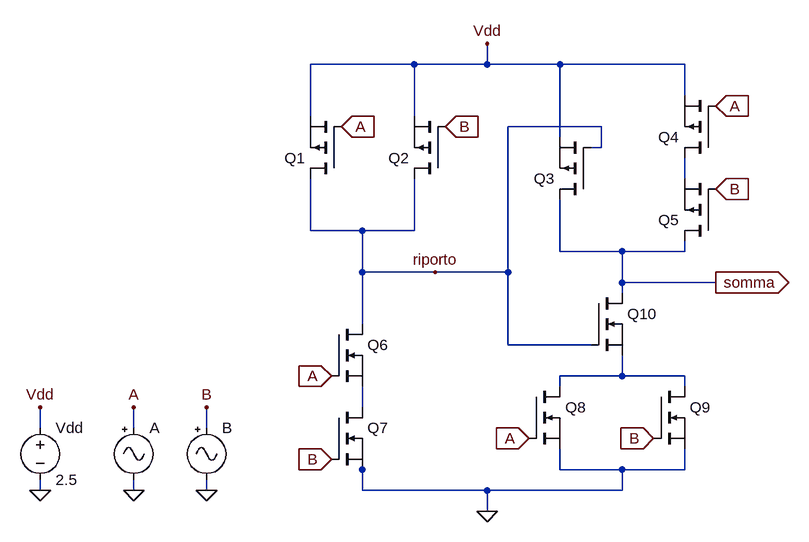
[diagram p0: schematic circuito2.asc]
circuito2.asc, the LTspice schematic file:
Version 4
SHEET 1 880 724
WIRE 192 16 32 16
WIRE 304 16 304 -16
WIRE 304 16 192 16
WIRE 416 16 304 16
WIRE 608 16 416 16
WIRE 608 64 608 16
WIRE 32 96 32 16
WIRE 192 96 192 16
WIRE 480 112 336 112
WIRE 416 128 416 16
WIRE 480 144 480 112
WIRE 480 144 464 144
WIRE 608 192 608 160
WIRE 32 272 32 192
WIRE 112 272 32 272
WIRE 192 272 192 192
WIRE 192 272 112 272
WIRE 416 304 416 224
WIRE 512 304 416 304
WIRE 608 304 608 288
WIRE 608 304 512 304
WIRE 112 336 112 272
WIRE 224 336 112 336
WIRE 336 336 336 112
WIRE 336 336 224 336
WIRE 512 352 512 304
WIRE 656 352 512 352
WIRE 512 368 512 352
WIRE 112 416 112 336
WIRE 336 448 336 336
WIRE 464 448 336 448
WIRE 512 496 512 464
WIRE 512 496 416 496
WIRE 608 496 512 496
WIRE 416 512 416 496
WIRE 608 512 608 496
WIRE 112 544 112 512
WIRE -384 576 -384 544
WIRE -240 576 -240 544
WIRE -128 576 -128 544
WIRE 112 640 112 624
WIRE 416 640 416 608
WIRE 512 640 416 640
WIRE 608 640 608 608
WIRE 608 640 512 640
WIRE -384 672 -384 656
WIRE -240 672 -240 656
WIRE -128 672 -128 656
WIRE 112 672 112 640
WIRE 304 672 112 672
WIRE 512 672 512 640
WIRE 512 672 304 672
WIRE 304 704 304 672
FLAG 304 704 0
FLAG -384 672 0
FLAG -240 672 0
FLAG -128 672 0
FLAG -384 544 Vdd
FLAG -240 544 A
FLAG -128 544 B
FLAG 304 -16 Vdd
FLAG 80 112 A
IOPIN 80 112 In
FLAG 64 496 A
IOPIN 64 496 In
FLAG 368 592 A
IOPIN 368 592 In
FLAG 656 80 A
IOPIN 656 80 In
FLAG 240 112 B
IOPIN 240 112 In
FLAG 64 624 B
IOPIN 64 624 In
FLAG 560 592 B
IOPIN 560 592 In
FLAG 656 208 B
IOPIN 656 208 In
FLAG 656 352 somma
IOPIN 656 352 Out
FLAG 224 336 riporto
SYMBOL voltage -384 560 R0
SYMATTR InstName Vdd
SYMATTR Value 2.5
SYMBOL Misc\\signal -240 560 R0
SYMATTR InstName A
SYMATTR Value ""
SYMBOL Misc\\signal -128 560 R0
SYMATTR InstName B
SYMATTR Value ""
SYMBOL pmos 80 192 R180
SYMATTR InstName Q1
SYMATTR Value ""
SYMBOL pmos 240 192 R180
SYMATTR InstName Q2
SYMATTR Value ""
SYMBOL pmos 464 224 R180
SYMATTR InstName Q3
SYMATTR Value ""
SYMBOL pmos 656 160 R180
SYMATTR InstName Q4
SYMATTR Value ""
SYMBOL pmos 656 288 R180
SYMATTR InstName Q5
SYMATTR Value ""
SYMBOL nmos 64 416 R0
SYMATTR InstName Q6
SYMATTR Value ""
SYMBOL nmos 64 544 R0
SYMATTR InstName Q7
SYMATTR Value ""
SYMBOL nmos 368 512 R0
SYMATTR InstName Q8
SYMATTR Value ""
SYMBOL nmos 560 512 R0
SYMATTR InstName Q9
SYMATTR Value ""
SYMBOL nmos 464 368 R0
SYMATTR InstName Q10
SYMATTR Value ""

The netlist it stands for:
* circuito2.asc
Vdd Vdd 0 2.5
V§A A 0
V§B B 0
M§Q1 riporto A Vdd Vdd
M§Q2 riporto B Vdd Vdd
M§Q3 somma riporto Vdd Vdd
M§Q4 N001 A Vdd Vdd
M§Q5 somma B N001 N001
M§Q6 riporto A N003 N003
M§Q7 N003 B 0 0
M§Q8 N002 A 0 0
M§Q9 N002 B 0 0
M§Q10 somma riporto N002 N002
.model NMOS NMOS
.model PMOS PMOS
.lib standard.mos
.backanno
.end